# EAGLE schematic 7segement4digits1badidea-shield-mk-3 (EAGLE 6.5.0)
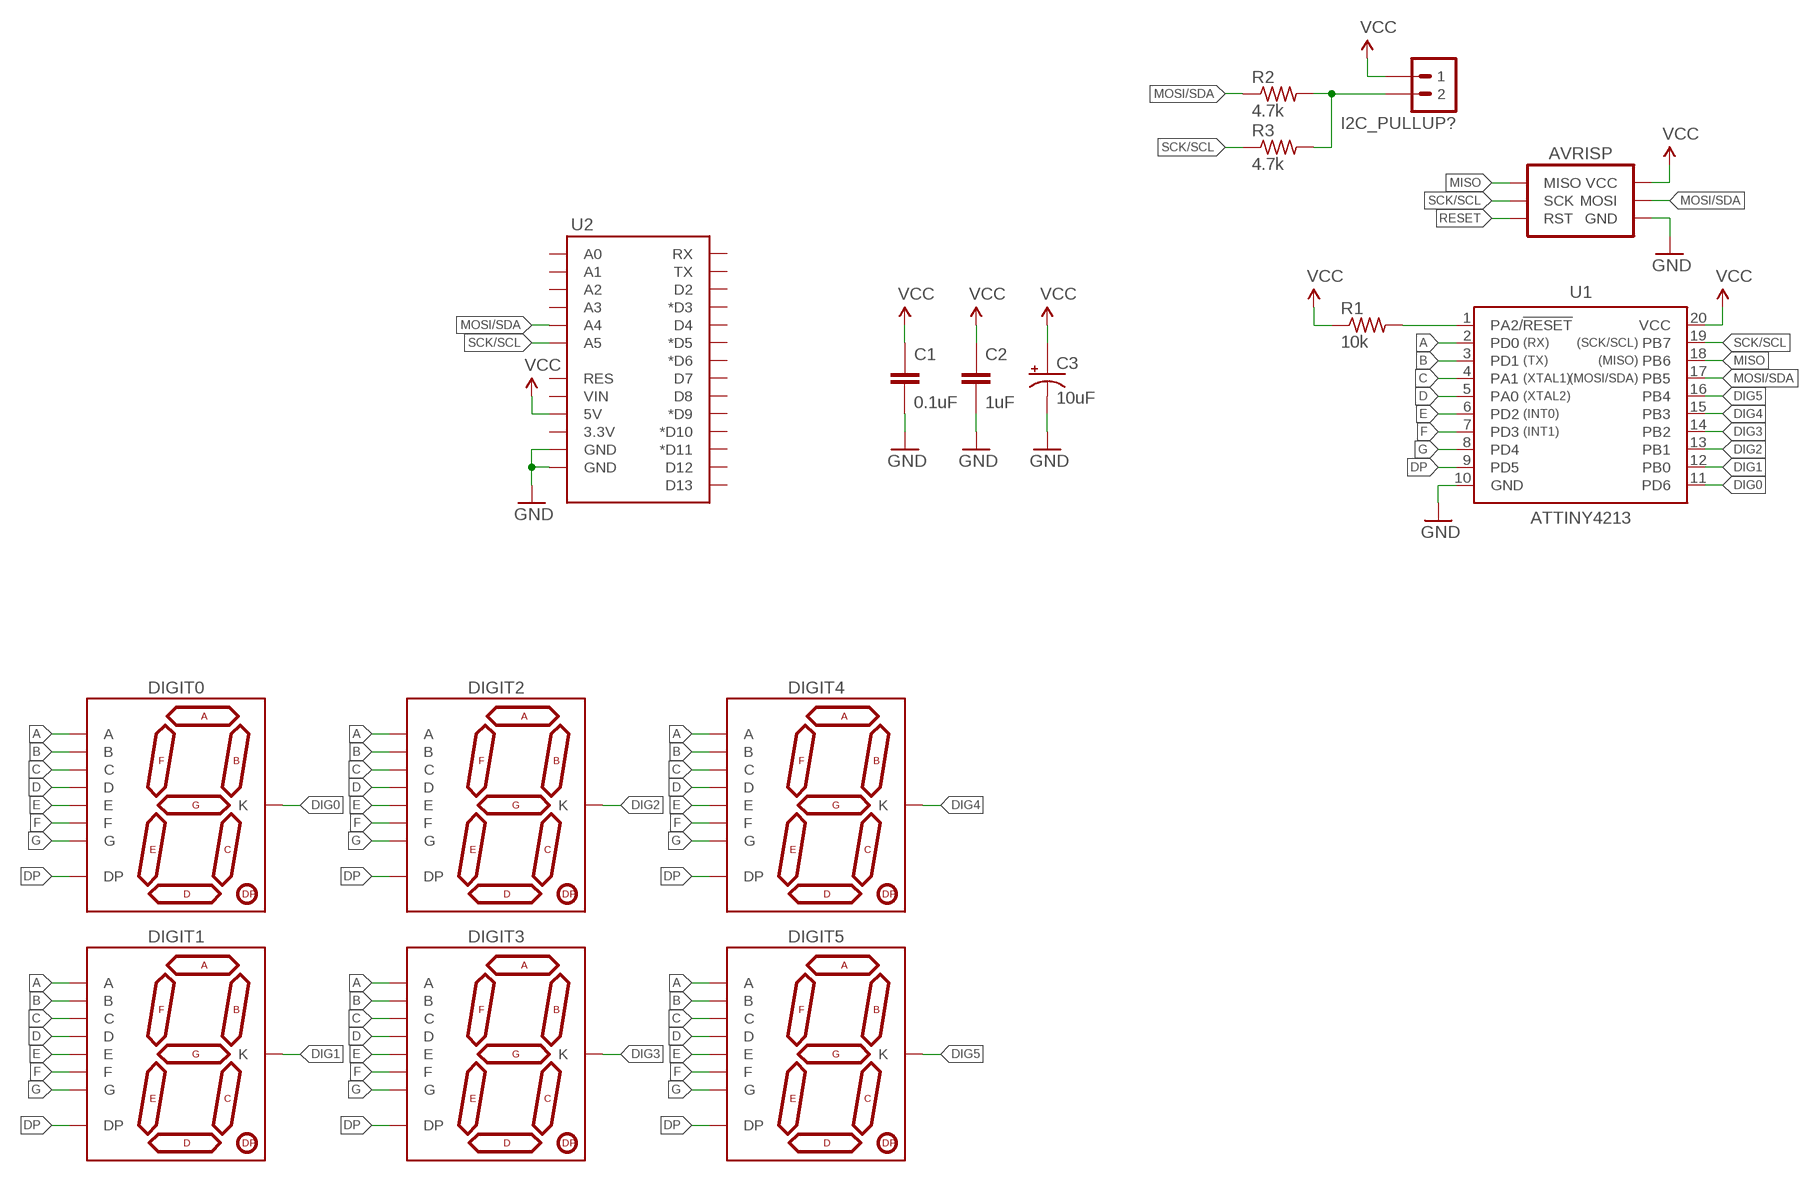
[diagram p0: schematic, sheet 1]

## Parts
AVRISP  AVR_SPI_PRG_6PTH  [2X3]
C1  0.1uF  CAPACITOR-CERAMIC025-024X044  [C025-024X044]
C2  1uF  CAPACITOR-CERAMIC025-024X044  [C025-024X044]
C3  10uF  CAPACITOR-POLARIZEDE2.5-5  [E2,5-5]
DIGIT0  7SEG_1DIGPTH-10MM  [7SEG_1DIG_10MM]
DIGIT1  7SEG_1DIGPTH-10MM  [7SEG_1DIG_10MM]
DIGIT2  7SEG_1DIGPTH-10MM  [7SEG_1DIG_10MM]
DIGIT3  7SEG_1DIGPTH-10MM  [7SEG_1DIG_10MM]
DIGIT4  7SEG_1DIGPTH-10MM  [7SEG_1DIG_10MM]
DIGIT5  7SEG_1DIGPTH-10MM  [7SEG_1DIG_10MM]
I2C_PULLUP?  M02PTH  [1X02]
R1  10k  RESISTORPTH-AXIAL-7.68MM  [RESISTOR-AXIAL-PTH-7.68MM]
R2  4.7k  RESISTORPTH-AXIAL-7.68MM  [RESISTOR-AXIAL-PTH-7.68MM]
R3  4.7k  RESISTORPTH-AXIAL-7.68MM  [RESISTOR-AXIAL-PTH-7.68MM]
U1  ATTINY4213  ATTINY2313ADIP  [DIL20]
U2  ARDUINO_SHIELD_SMALLER  [ARDUINO_SHIELD_NOOUTLINE_INSIDE_SMALLER]

## Nets
A: DIGIT0.10(A) DIGIT1.10(A) DIGIT2.10(A) DIGIT3.10(A) DIGIT4.10(A) DIGIT5.10(A) U1.2(PD0)
B: DIGIT0.9(B) DIGIT1.9(B) DIGIT2.9(B) DIGIT3.9(B) DIGIT4.9(B) DIGIT5.9(B) U1.3(PD1)
C: DIGIT0.8(C) DIGIT1.8(C) DIGIT2.8(C) DIGIT3.8(C) DIGIT4.8(C) DIGIT5.8(C) U1.4(PA1)
D: DIGIT0.5(D) DIGIT1.5(D) DIGIT2.5(D) DIGIT3.5(D) DIGIT4.5(D) DIGIT5.5(D) U1.5(PA0)
DIG0: DIGIT0.1(K) DIGIT0.6(K) U1.11(PD6)
DIG1: DIGIT1.1(K) DIGIT1.6(K) U1.12(PB0)
DIG2: DIGIT2.1(K) DIGIT2.6(K) U1.13(PB1)
DIG3: DIGIT3.1(K) DIGIT3.6(K) U1.14(PB2)
DIG4: DIGIT4.1(K) DIGIT4.6(K) U1.15(PB3)
DIG5: DIGIT5.1(K) DIGIT5.6(K) U1.16(PB4)
DP: DIGIT0.7(DP) DIGIT1.7(DP) DIGIT2.7(DP) DIGIT3.7(DP) DIGIT4.7(DP) DIGIT5.7(DP) U1.9(PD5)
E: DIGIT0.4(E) DIGIT1.4(E) DIGIT2.4(E) DIGIT3.4(E) DIGIT4.4(E) DIGIT5.4(E) U1.6(PD2)
F: DIGIT0.2(F) DIGIT1.2(F) DIGIT2.2(F) DIGIT3.2(F) DIGIT4.2(F) DIGIT5.2(F) U1.7(PD3)
G: DIGIT0.3(G) DIGIT1.3(G) DIGIT2.3(G) DIGIT3.3(G) DIGIT4.3(G) DIGIT5.3(G) U1.8(PD4)
GND: AVRISP.6(GND) C1.2 C2.2 C3.- U1.10(GND) U2.GND@0(GND) U2.GND@1(GND)
MISO: AVRISP.1(MISO) U1.18(PB6)
MOSI/SDA: AVRISP.4(MOSI) R2.P$1 U1.17(PB5) U2.A4
N$1: R1.P$2 U1.1(PA2/!RESET)
N$4: I2C_PULLUP?.2 R2.P$2 R3.P$2
RESET: AVRISP.5(RST)
SCK/SCL: AVRISP.3(SCK) R3.P$1 U1.19(PB7) U2.A5
VCC: AVRISP.2(VCC) C1.1 C2.1 C3.+ I2C_PULLUP?.1 R1.P$1 U1.20(VCC) U2.5V
Unconnected: U2.3.3V U2.A0 U2.A1 U2.A2 U2.A3 U2.D2 U2.D3(*D3) U2.D4 U2.D5(*D5) U2.D6(*D6) U2.D7 U2.D8 U2.D9(*D9) U2.D10(*D10) U2.D11(*D11) U2.D12 U2.D13 U2.RES U2.RX U2.TX U2.VIN

## Library data of the parts
AVRISP = A_butts:AVR_SPI_PRG_6: AVR ISP 6 Pin This is the reduced ISP connector for AVR programming. Common on Arduino. This footprint will take up less PCB space and can be used with a 10-pin to 6-pin adapter such as SKU: BOB-08508 **Special note about "TEST_POINT" package. The stop mask is on the top side, so if you want your programming test points to be on the bottom of your board, make sure to place this package on the bottom side of the board. This also ensure that the orientation to program from the bottom side will be correct.
C1 C2 = A_butts:CAPACITOR-CERAMIC: CAPACITOR, European symbol
C3 = A_butts:CAPACITOR-POLARIZED: POLARIZED CAPACITOR, American symbol
DIGIT0 DIGIT1-DIGIT5 = A_butts:7SEG_1DIG
I2C_PULLUP? = A_butts:M02: Standard 2-pin 0.1" header. Use with - straight break away headers ( PRT-00116) - right angle break away headers (PRT-00553) - swiss pins (PRT-00743) - machine pins (PRT-00117) - female headers (PRT-00115) Molex polarized connector foot print use with: PRT-08233 with associated crimp pins and housings. 2.54_SCREWTERM for use with PRT-10571. 3.5mm Screw Terminal footprints for PRT-08084 5mm Screw Terminal footprints for use with PRT-08433
R1-R3 = A_butts:RESISTOR: RESISTOR, American symbol
U1 = A_butts:ATTINY2313A: ATTINY2313A 2kB 20MHz I2C/SPI/UART
U2 = A_butts:ARDUINO_SHIELD_SMALLER